# Altium schematic sheet secondary_LTC.SchDoc: foxBMS BMS-Slave 12-Cell
size A3; DocumentNumber: 3; SheetNumber: 3; SheetTotal: 19; AUTHOR: Fraunhofer IISB foxBMS Team; SheetDescription: Secondary LTC6811
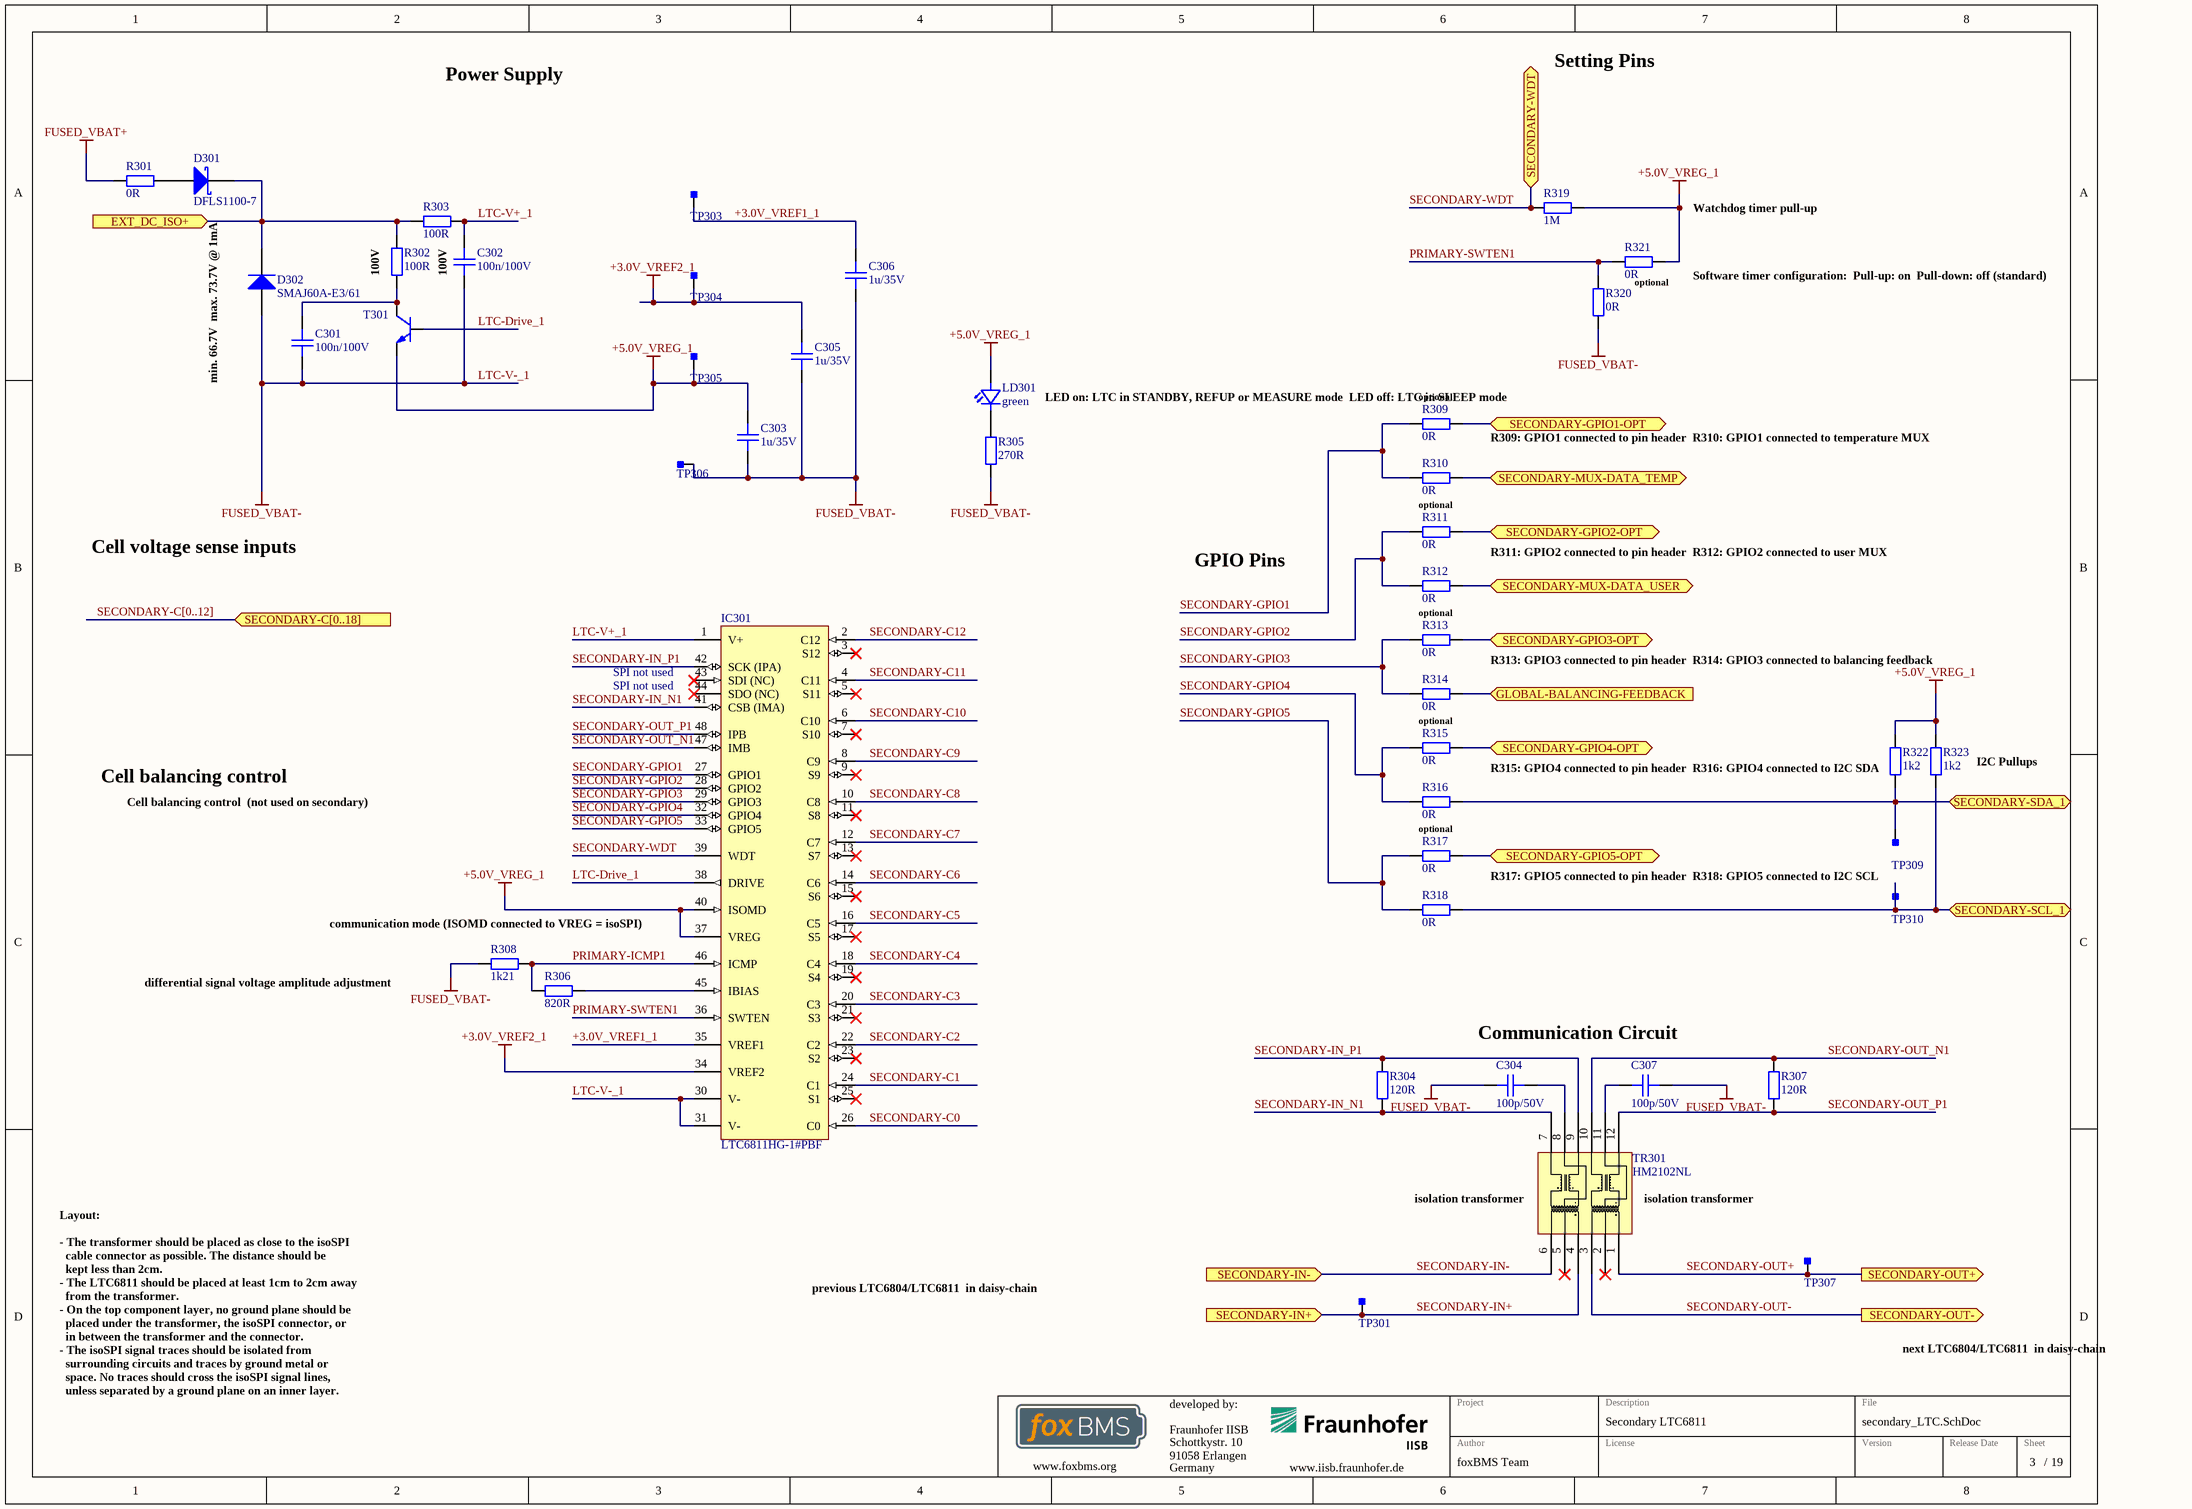
[diagram p0: secondary_LTC.SchDoc]

## Parts
C301  100n/100V  [CAPC2012X14N]
C302  100n/100V  [CAPC2012X14N]
C303  1u/35V  [CAPC1608X08N]
C304  100p/50V  [CAPC1608X08N]
C305  1u/35V  [CAPC1608X08N]
C306  1u/35V  [CAPC1608X08N]
C307  100p/50V  [CAPC1608X08N]
D301  DFLS1100-7  [DIOD-POWERDI123-2_V]
D302  SMAJ60A-E3/61  [VISH-DO-214AC-2_N]
IC301  LTC6811HG-1#PBF  [LT-G-48_L]
LD301  green  [LEDC1608X07N]
R301  0R  [RESC2012X05N]
R302  100R  [RESC2012X05N]
R303  100R  [RESC2012X05N]
R304  120R  [RESC1608X05N]
R305  270R  [RESC1608X05N]
R306  820R  [RESC1608X05N]
R307  120R  [RESC1608X05N]
R308  1k21  [RESC1608X05N]
R309  0R  [RESC1608X05N]
R310  0R  [RESC1608X05N]
R311  0R  [RESC1608X05N]
R312  0R  [RESC1608X05N]
R313  0R  [RESC1608X05N]
R314  0R  [RESC1608X05N]
R315  0R  [RESC1608X05N]
R316  0R  [RESC1608X05N]
R317  0R  [RESC1608X05N]
R318  0R  [RESC1608X05N]
R319  1M  [RESC1608X05N]
R320  0R  [RESC1608X05N]
R321  0R  [RESC1608X05N]
R322  1k2  [RESC1608X05N]
R323  1k2  [RESC1608X05N]
T301  PBHV8115Z  [SOT230P700X180-4N]  (value not drawn)
TP301  Testpoint_Square  [Testpoint_S1]  (value not drawn)  (no BOM)
TP303  Testpoint_Square  [Testpoint_S1]  (value not drawn)  (no BOM)
TP304  Testpoint_Square  [Testpoint_S1]  (value not drawn)  (no BOM)
TP305  Testpoint_Square  [Testpoint_S1]  (value not drawn)  (no BOM)
TP306  Testpoint_Square  [Testpoint_S1]  (value not drawn)  (no BOM)
TP307  Testpoint_Square  [Testpoint_S1]  (value not drawn)  (no BOM)
TP309  Testpoint_Square  [Testpoint_S1]  (value not drawn)  (no BOM)
TP310  Testpoint_Square  [Testpoint_S1]  (value not drawn)  (no BOM)
TR301  HM2102NL  [HM2102NL]

## Ports
EXT_DC_ISO+ (in), GLOBAL-BALANCING-FEEDBACK (in), SECONDARY-C[0..18] (in), SECONDARY-GPIO1-OPT (bidir), SECONDARY-GPIO2-OPT (bidir), SECONDARY-GPIO3-OPT (bidir), SECONDARY-GPIO4-OPT (bidir), SECONDARY-GPIO5-OPT (bidir), SECONDARY-IN+ (in), SECONDARY-IN- (in), SECONDARY-MUX-DATA_TEMP (bidir), SECONDARY-MUX-DATA_USER (bidir), SECONDARY-OUT+ (out), SECONDARY-OUT- (out), SECONDARY-SCL_1 (bidir), SECONDARY-SDA_1 (bidir), SECONDARY-WDT (bidir)

## Nets
+3.0V_VREF2_1: C305.2 IC301.34(VREF2) TP304.1
+5.0V_VREG_1: C303.2 IC301.37(VREG) IC301.40(ISOMD) LD301.2(A) R319.2 R321.2 R322.2 R323.2 T301.3(E) TP305.1
FUSED_VBAT+: R301.1
LTC-V-_1: C301.2 C302.2 C303.1 C304.1 C305.1 C306.1 C307.1 D302.2(A) IC301.30(V-) IC301.31(V-) R305.1 R308.1 R320.1 TP306.1  [also labelled FUSED_VBAT-]
+3.0V_VREF1_1: C306.2 IC301.35(VREF1) TP303.1
EXT_DC_ISO+: D301.2(K) D302.1(K) R302.2 R303.1 ; port EXT_DC_ISO+
GLOBAL-BALANCING-FEEDBACK: R314.1 ; port GLOBAL-BALANCING-FEEDBACK
LTC-Drive_1: IC301.38(DRIVE) T301.1(B)
LTC-V+_1: C302.1 IC301.1(V+) R303.2
PRIMARY-ICMP1: IC301.46(ICMP) R306.1 R308.2
PRIMARY-SWTEN1: IC301.36(SWTEN) R320.2 R321.1
SECONDARY-C0: IC301.26(C0)
SECONDARY-C1: IC301.24(C1)
SECONDARY-C2: IC301.22(C2)
SECONDARY-C3: IC301.20(C3)
SECONDARY-C4: IC301.18(C4)
SECONDARY-C5: IC301.16(C5)
SECONDARY-C6: IC301.14(C6)
SECONDARY-C7: IC301.12(C7)
SECONDARY-C8: IC301.10(C8)
SECONDARY-C9: IC301.8(C9)
SECONDARY-C10: IC301.6(C10)
SECONDARY-C11: IC301.4(C11)
SECONDARY-C12: IC301.2(C12)
SECONDARY-GPIO1: IC301.27(GPIO1) R309.2 R310.2
SECONDARY-GPIO1-OPT: R309.1 ; port SECONDARY-GPIO1-OPT
SECONDARY-GPIO2: IC301.28(GPIO2) R311.2 R312.2
SECONDARY-GPIO2-OPT: R311.1 ; port SECONDARY-GPIO2-OPT
SECONDARY-GPIO3: IC301.29(GPIO3) R313.2 R314.2
SECONDARY-GPIO3-OPT: R313.1 ; port SECONDARY-GPIO3-OPT
SECONDARY-GPIO4: IC301.32(GPIO4) R315.2 R316.2
SECONDARY-GPIO4-OPT: R315.1 ; port SECONDARY-GPIO4-OPT
SECONDARY-GPIO5: IC301.33(GPIO5) R317.2 R318.2
SECONDARY-GPIO5-OPT: R317.1 ; port SECONDARY-GPIO5-OPT
SECONDARY-IN+: TP301.1 TR301.4 ; port SECONDARY-IN+
SECONDARY-IN-: TR301.6 ; port SECONDARY-IN-
SECONDARY-IN_N1: IC301.41(CSB_(IMA)) R304.2 TR301.7
SECONDARY-IN_P1: IC301.42(SCK_(IPA)) R304.1 TR301.9
SECONDARY-MUX-DATA_TEMP: R310.1 ; port SECONDARY-MUX-DATA_TEMP
SECONDARY-MUX-DATA_USER: R312.1 ; port SECONDARY-MUX-DATA_USER
SECONDARY-OUT+: TP307.1 TR301.1 ; port SECONDARY-OUT+
SECONDARY-OUT-: TR301.3 ; port SECONDARY-OUT-
SECONDARY-OUT_N1: IC301.47(IMB) R307.2 TR301.10
SECONDARY-OUT_P1: IC301.48(IPB) R307.1 TR301.12
SECONDARY-SCL_1: R318.1 R323.1 TP310.1 ; port SECONDARY-SCL_1
SECONDARY-SDA_1: R316.1 R322.1 TP309.1 ; port SECONDARY-SDA_1
SECONDARY-WDT: IC301.39(WDT) R319.1 ; port SECONDARY-WDT
NetC301_1: C301.1 R302.1 T301.2(C) T301.4(C)
NetC304_2: C304.2 TR301.8
NetC307_2: C307.2 TR301.11
NetD301_1: D301.1(A) R301.2
NetIC301_45: IC301.45(IBIAS) R306.2
NetLD301_1: LD301.1(C) R305.2

Not connected (* = marked no-connect by the designer): IC301 3(S12)* 5(S11)* 7(S10)* 9(S9)* 11(S8)* 13(S7)* 15(S6)* 17(S5)* 19(S4)* 21(S3)* 23(S2)* 25(S1)* 43(SDI_(NC))* 44(SDO_(NC))*; TR301 2* 5*

## Buses and harness runs
bus SECONDARY-C[0..12] = port SECONDARY-C[0..18]

## Notes on the sheet
- Power Supply
- Setting Pins
- Watchdog timer pull-up
- min. 66.7V
  max. 73.7V @ 1mA
- (near R302) 100V
- (near C302) 100V
- (near R321) optional
- (near R321) Software timer configuration:
  Pull-up: on
  Pull-down: off (standard)
- (near R309) LED on: LTC in STANDBY, REFUP or MEASURE mode
  LED off: LTC in SLEEP mode
- (near R309) optional
- R309: GPIO1 connected to pin header
  R310: GPIO1 connected to temperature MUX
- optional
- Cell voltage sense inputs
- GPIO Pins
- R311: GPIO2 connected to pin header
  R312: GPIO2 connected to user MUX
- (near IC301) SPI not used
- R313: GPIO3 connected to pin header
  R314: GPIO3 connected to balancing feedback
- Cell balancing control
- (near R322) R315: GPIO4 connected to pin header
  R316: GPIO4 connected to I2C SDA
- (near R323) I2C Pullups
- Cell balancing control
  (not used on secondary)
- (near R308) communication mode (ISOMD connected to VREG = isoSPI)
- (near TP310) R317: GPIO5 connected to pin header
  R318: GPIO5 connected to I2C SCL
- differential signal voltage amplitude adjustment
- Communication Circuit
- (near TR301) isolation transformer
- previous LTC6804/LTC6811
  in daisy-chain
- next LTC6804/LTC6811
  in daisy-chain
- Layout:
  - The transformer should be placed as close to the isoSPI
  cable connector as possible. The distance should be
  kept less than 2cm.
  - The LTC6811 should be placed at least 1cm to 2cm away
  from the transformer.
  - On the top component layer, no ground plane should be
  placed under the transformer, the isoSPI connector, or
  in between the transformer and the connector.
  - The isoSPI signal traces should be isolated from
  surrounding circuits and traces by ground metal or
  space. No traces should cross the isoSPI signal lines,
  unless separated by a ground plane on an inner layer.
- Fraunhofer IISB
- Schottkystr. 10
- developed by:
- 91058 Erlangen
- Germany
- Author
- Project
- License
- Description
- File
- Version
- Release Date
- Sheet
- www.foxbms.org
- www.iisb.fraunhofer.de
- foxBMS Team
- /

## Library data of the parts
C301 C302 = gen_C_ceramic_100n_100V_X7R_0805: MLCC; Capacitance: 100n; Rated Voltage: 100V; Dielectric: X7R; Case EIA: 0805; Case Metric: 2012; Automotive Qualified: False; Part Number: gen_C_ceramic_100n_100V_X7R_0805; Supplier 1: Farnell; Supplier Part Number 1: 2320821
C303 C305 C306 = gen_C_ceramic_1u_35V_X7R_0603: MLCC; Capacitance: 1u; Rated Voltage: 35V; Dielectric: X7R; Case EIA: 0603; Case Metric: 1608; PnP Package: C_0603_10; PnP Value: 1uF/35V/X7R; PnP equipped: x; Automotive Qualified: False; Part Number: gen_C_ceramic_1u_35V_X7R_0603; Supplier 1: Farnell; Supplier Part Number 1: 1907508
C304 C307 = gen_C_ceramic_100p_50V_C0G_0603: MLCC; Capacitance: 100p; Rated Voltage: 50V; Dielectric: C0G; Case EIA: 0603; Case Metric: 1608; Automotive Qualified: False; Part Number: gen_C_ceramic_100p_50V_C0G_0603; Supplier 1: Farnell; Supplier Part Number 1: 1414603
D301 = CMP-2000-05099-1: 1 A High Voltage Schottky Barrier Rectifier, 0.62 V, -55 to 175 degC, 2- Pin POWERDI123, Pb-Free, Tape and Reel; Manufacturer: Diodes Inc; Average Rectified Current-Max: 1A; Peak Current-Max: 40A; Forward Voltage: 0.77V; Reverse Current-Max: 1µA; Reverse Voltage-Max [Vrrm]: 100V; Datasheet Version: Sep-14; Datasheet URL: https://datasheet.ciiva.com/15144/getdatasheetpartid-44146-15144126.pdf; Manufacturer URL: http://www.diodes.com/
D302 = CMP-0548-00258-2: Transient Voltage Suppressor, 6.40 to 231 V, 60 V Stand-off Voltage, Uni-Directional, -55 to 155 degC, 2-pin DO-214AC, Pb-Free, Tape and Reel; Manufacturer: Vishay Semiconductor; VWM (V): 60; PPPM (W): 400, 300; VBR Uni-Directional (V): 6.4 to 231; IFSM: 40 A; ID (uA): 1; RoHS: TRUE; ComponentLink3Description: Package Specification; PackageReference: DO-214AC-2; PartNumber: SMAJ60A-E3/61; ComponentLink2Description: Datasheet; ComponentLink2URL: http://www.vishay.com/docs/88390/smaj50a.pdf; ComponentLink3URL: http://www.vishay.com/docs/88390/smaj50a.pdf; Packing: Tape and Reel; ComponentLink1Description: Manufacturer URL; PackageDescription: 2-Pin DO-214AC (SMA), Body 4.245 x 2.665 mm; DatasheetVersion: 12/8/2013; ComponentLink1URL: http://www.vishay.com/; Operating Junction and Storage Temperature Range: -55 to 150 degC; Mounting Technology: Surface Mount
IC301 = LTC6811HG-1#PBF: Multicell Battery Monitor, 60 V Vin MAX, 48-pin SOP (G-48), -40 to 125 degC, Pb-Free; Manufacturer: Linear Technology; Type of Charger: Battery Stack Monitor; Vin Max(V): 60; Battery Chemistry: Li-Ion, Li-Polymer, NiMH; Number of Cells: > 1000 V of stacked Li-Ion cells; Automotive Qualified: False; RoHS: TRUE; ComponentLink1Description: Datasheet; ComponentLink1URL: https://cds.linear.com/docs/en/datasheet/68111fb.pdf; PartNumber: LTC6811HG-1#PBF; PackageReference: G-48; PackageVersion: Rev. Ã˜, 01/2011; ComponentLink2Description: Datasheet; Mounting Technology: Surface Mount; ComponentLink3Description: Package Specification; PackageDescription: 48-Pin Plastic SSOP, Body 12.8 x 5.3 mm, Pitch 0.5 mm; ComponentLink3URL: http://cds.linear.com/docs/en/packaging/05081887_0_G48.pdf; ComponentLink2URL: http://cds.linear.com/docs/en/datasheet/680412f.pdf; Part Number: LTC6811HG-1#PBF; Part Name: LTC6811HG-1#PBF; Operating Temperature: -40°C - +125°C; Supplier 1: Digikey; Supplier Part Number 1: LTC6811HG-1#PBF-ND
LD301 = gen_LED_0603_green: LED; Breakdown Voltage: 5V; Continuous Forward Current: 20mA; Forward Voltage @ 20mA: 2.2V; Automotive Qualified: False; Part Number: gen_LED_0603_green; Color: green; Supplier 1: Farnell; Supplier Part Number 1: 2099223; PnP Package: LED_0603
R301 = gen_R_0R_0805: SMD Resistor 0R 0805; Power: 0.125W; Case EIA: 0805; Case Metric: 2012; Maximum Working Voltage: 150V; PnP Package: R_0805; Automotive Qualified: False; Part Number: gen_R_0R_0805; Operating Temperature: -55°C - +155°C; Resistance: 0R; Series: Jumper; PnP Value: 0R; Supplier 1: Farnell; Supplier Part Number 1: 2057661
R302 R303 = gen_R_100R_0805: SMD Resistor 100R 0805; Tolerance: 1%; Power: 0.125W; Case EIA: 0805; Case Metric: 2012; Maximum Working Voltage: 150V; PnP Package: R_0805; Automotive Qualified: False; Part Number: gen_R_100R_0805; Operating Temperature: -55°C - +155°C; Resistance: 100R; Series: E24, E96; PnP Value: 100R; Supplier 1: Farnell; Supplier Part Number 1: 1469862
R304 R307 = gen_R_120R_0603: SMD Resistor 120R 0603; Tolerance: 1%; Power: 0.1W; Case EIA: 0603; Case Metric: 1608; Maximum Working Voltage: 75V; PnP Package: R_0603; Automotive Qualified: False; Part Number: gen_R_120R_0603; Operating Temperature: -55°C - +155°C; Resistance: 120R; Series: E24; PnP Value: 120R; Supplier 1: Farnell; Supplier Part Number 1: 2073369
R305 = gen_R_270R_0603: SMD Resistor 270R 0603; Tolerance: 1%; Power: 0.1W; Case EIA: 0603; Case Metric: 1608; Maximum Working Voltage: 75V; PnP Package: R_0603; Automotive Qualified: False; Part Number: gen_R_270R_0603; Operating Temperature: -55°C - +155°C; Resistance: 270R; Series: E24; PnP Value: 270R; Supplier 1: Farnell; Supplier Part Number 1: 2141320
R306 = gen_R_820R_0603: SMD Resistor 820R 0603; Tolerance: 1%; Power: 0.1W; Case EIA: 0603; Case Metric: 1608; Maximum Working Voltage: 75V; PnP Package: R_0603; Automotive Qualified: False; Part Number: gen_R_820R_0603; Operating Temperature: -55°C - +155°C; Resistance: 820R; Series: E24; PnP Value: 820R; Supplier 1: Farnell; Supplier Part Number 1: 1469841
R308 = gen_R_1k21_0603: SMD Resistor 1k21 0603; Tolerance: 1%; Power: 0.1W; Case EIA: 0603; Case Metric: 1608; Maximum Working Voltage: 75V; PnP Package: R_0603; Automotive Qualified: False; Part Number: gen_R_1k21_0603; Operating Temperature: -55°C - +155°C; Resistance: 1k21; Series: E96; PnP Value: 1k21; Supplier 1: Farnell; Supplier Part Number 1: 1652852
R309-R318 R320 R321 = gen_R_0R_0603: SMD Resistor 0R 0603; Power: 0.1W; Case EIA: 0603; Case Metric: 1608; Maximum Working Voltage: 75V; PnP Package: R_0603; Automotive Qualified: False; Part Number: gen_R_0R_0603; Operating Temperature: -55°C - +155°C; Resistance: 0R; Series: Jumper; PnP Value: 0R; Supplier 1: Farnell; Supplier Part Number 1: 2073345
R319 = gen_R_1M_0603: SMD Resistor 1M 0603; Tolerance: 1%; Power: 0.1W; Case EIA: 0603; Case Metric: 1608; Maximum Working Voltage: 75V; PnP Package: R_0603; Automotive Qualified: False; Part Number: gen_R_1M_0603; Operating Temperature: -55°C - +155°C; Resistance: 1M; Series: E24, E96; PnP Value: 1M; Supplier 1: Farnell; Supplier Part Number 1: 1469746
R322 R323 = gen_R_1k2_0603: SMD Resistor 1k2 0603; Tolerance: 1%; Power: 0.1W; Case EIA: 0603; Case Metric: 1608; Maximum Working Voltage: 75V; PnP Package: R_0603; Automotive Qualified: False; Part Number: gen_R_1k2_0603; Operating Temperature: -55°C - +155°C; Resistance: 1k2; Series: E24; PnP Value: 1k2; Supplier 1: Farnell; Supplier Part Number 1: 2073370
T301 = PBHV8115Z: 150 V, 1 A NPN high-voltage low V / CEsat / (BISS) transistor; Manufacturer: Nexperia; Maximum Drain-Source Voltage: 150V; Maximum Continous Drain Current (25°C): 1A; Automotive Qualified: True; Part Number: PBHV8115Z; Part Name: NPN; Operating Temperature: -55°C - +150°C; ComponentLink1Description: Datasheet; ComponentLink1URL: http://www.farnell.com/datasheets/609423.pdf; Supplier 1: Farnell; Supplier Part Number 1: 1829309
TP301 TP303-TP307 TP309 TP310 = Testpoint_Square: Testpoint, square; Part Number: Testpoint_Square
TR301 = HM2102NL: Pulse HM2102NL BMS Transformer; Automotive Qualified: True; Part Number: HM2102NL; Manufacturer: Pulse; Operating Temperature: -40°C - +125°C; ComponentLink1Description: Datasheet; ComponentLink1URL: https://www.mouser.com/ds/2/336/HM2102NL-1218600.pdf; Supplier 1: Mouser; Supplier Part Number 1: 673-HM2102NL; Supplier 2: Digikey; Supplier Part Number 2: 1840-1034-1-ND